# Altium schematic sheet MAX2829_RF.SchDoc
size A4
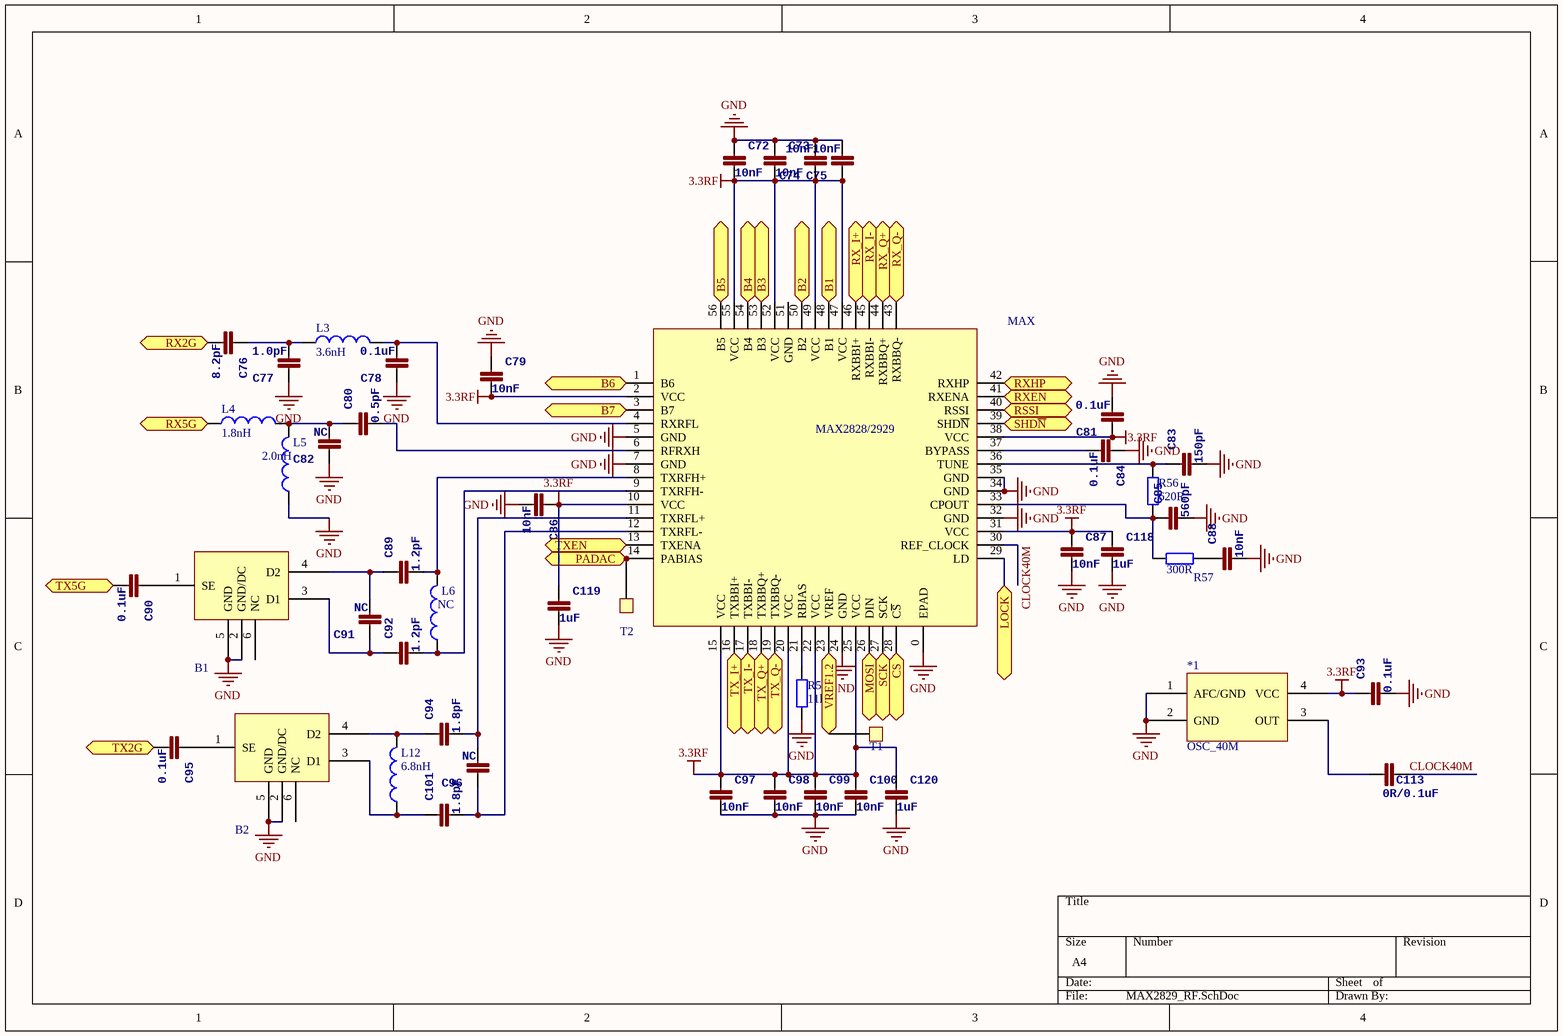
[diagram p0: MAX2829_RF.SchDoc]

## Parts
*1  OSC_40M  [TXC_7Q]
B1  Balun  [HHM1711D1/HHM1732B1]  (value not drawn)
B2  Balun  [HHM1711D1/HHM1732B1]  (value not drawn)
C72  10nF  [0402]
C73  10nF  [0402]
C74  10nF  [0402]
C75  10nF  [0402]
C76  8.2pF  [0402]
C77  1.0pF  [0402]
C78  0.1uF  [0402]
C79  10nF  [0402]
C80  0.5pF  [0402]
C81  0.1uF  [0402]
C82  NC  [0402]
C83  150pF  [0402]
C84  0.1uF  [0402]
C85  560pF  [0402]
C86  10nF  [0402]
C87  10nF  [0402]
C88  10nF  [0402]
C89  1.2pF  [0402]
C90  0.1uF  [0402]
C91  NC  [0402]
C92  1.2pF  [0402]
C93  0.1uF  [0402]
C94  1.8pF  [0402]
C95  0.1uF  [0402]
C96  NC  [0402]
C97  10nF  [0402]
C98  10nF  [0402]
C99  10nF  [0402]
C100  10nF  [0402]
C101  1.8pF  [0402]
C113  0R/0.1uF  [0402]
C118  1uF  [0603]
C119  1uF  [0603]
C120  1uF  [0603]
L3  value 3.6nH  [0402]  (hidden comment: Inductor)
L4  value 1.8nH  [0402]  (hidden comment: Inductor)
L5  2.0nH  [0402]
L6  NC  [0402]
L12  value 6.8nH  [0402]  (hidden comment: Inductor)
MAX  MAX2828/2929  [QFN_56\MAX2829]
R56  620R  [0402]
R57  300R  [0402]
R58  11k  [0402]
T1  TestPad  [TestPad - 1mm]  (value not drawn)
T2  TestPad  [TestPad - 1mm]  (value not drawn)

## Ports
B1, B2, B3, B4, B5, B6, B7, CS, LOCK, MOSI, PADAC, RSSI, RX2G, RX5G, RX_I+, RX_I-, RX_Q+, RX_Q-, RXEN, RXHP, SCK, SHD~{N}, TX2G, TX5G, TX_I+, TX_I-, TX_Q+, TX_Q-, TXEN, VREF1.2

## Nets
3.3RF: *1.4(VCC) C72.2 C73.2 C74.1 C75.1 C79.2 C81.1 C86.1 C87.1 C93.1 C97.1 C98.1 C99.1 C100.1 C118.1 C119.1 C120.1 MAX.2(VCC) MAX.10(VCC) MAX.15(VCC) MAX.20(VCC) MAX.22(VCC) MAX.25(VCC) MAX.31(VCC) MAX.38(VCC) MAX.47(VCC) MAX.49(VCC) MAX.52(VCC) MAX.55(VCC)
GND: *1.1(AFC/GND) *1.2(GND) B1.2(GND/DC) B1.5(GND) B2.2(GND/DC) B2.5(GND) C72.1 C73.1 C74.2 C75.2 C77.1 C78.1 C79.1 C81.2 C82.1 C83.2 C84.1 C85.2 C86.2 C87.2 C88.2 C93.2 C97.2 C98.2 C99.2 C100.2 C118.2 C119.2 C120.2 L5.1 MAX.0(EPAD) MAX.5(GND) MAX.7(GND) MAX.24(GND) MAX.32(GND) MAX.34(GND) MAX.35(GND) R58.1
B1: MAX.48(B1) ; port B1
B2: MAX.50(B2) ; port B2
B3: MAX.53(B3) ; port B3
B4: MAX.54(B4) ; port B4
B5: MAX.56(B5) ; port B5
B6: MAX.1(B6) ; port B6
B7: MAX.3(B7) ; port B7
CLOCK40M: C113.2 MAX.30(REF_CLOCK)
CS: MAX.28(C~{S}) ; port CS
LOCK: MAX.29(LD) ; port LOCK
MOSI: MAX.26(DIN) ; port MOSI
PADAC: MAX.14(PABIAS) T2.1 ; port PADAC
RSSI: MAX.40(RSSI) ; port RSSI
RX2G: C76.2 ; port RX2G
RX5G: L4.1 ; port RX5G
RX_I+: MAX.46(RXBBI+) ; port RX_I+
RX_I-: MAX.45(RXBBI-) ; port RX_I-
RX_Q+: MAX.44(RXBBQ+) ; port RX_Q+
RX_Q-: MAX.43(RXBBQ-) ; port RX_Q-
RXEN: MAX.41(RXENA) ; port RXEN
RXHP: MAX.42(RXHP) ; port RXHP
SCK: MAX.27(SCK) ; port SCK
SHD~{N}: MAX.39(SHD~{N}) ; port SHD~{N}
TX2G: C95.2 ; port TX2G
TX5G: C90.2 ; port TX5G
TX_I+: MAX.16(TXBBI+) ; port TX_I+
TX_I-: MAX.17(TXBBI-) ; port TX_I-
TX_Q+: MAX.18(TXBBQ+) ; port TX_Q+
TX_Q-: MAX.19(TXBBQ-) ; port TX_Q-
TXEN: MAX.13(TXENA) ; port TXEN
VREF1.2: MAX.23(VREF) T1.1 ; port VREF1.2
Net*1_3: *1.3(OUT) C113.1
NetB1_1: B1.1(SE) C90.1
NetB1_3: B1.3(D1) C91.1 C92.1
NetB1_4: B1.4(D2) C89.1 C91.2
NetB2_1: B2.1(SE) C95.1
NetB2_3: B2.3(D1) C101.1 L12.1
NetB2_4: B2.4(D2) C94.1 L12.2
NetC76_1: C76.1 C77.2 L3.1
NetC78_2: C78.2 L3.2 MAX.4(RXRFL)
NetC80_1: C80.1 C82.2 L4.2 L5.2
NetC80_2: C80.2 MAX.6(RFRXH)
NetC83_1: C83.1 MAX.36(TUNE) R56.1
NetC84_2: C84.2 MAX.37(BYPASS)
NetC85_1: C85.1 MAX.33(CPOUT) R56.2 R57.1
NetC88_1: C88.1 R57.2
NetC89_2: C89.2 L6.2 MAX.8(TXRFH+)
NetC92_2: C92.2 L6.1 MAX.9(TXRFH-)
NetC94_2: C94.2 C96.2 MAX.11(TXRFL+)
NetC96_1: C96.1 C101.2 MAX.12(TXRFL-)
NetMAX_21: MAX.21(RBIAS) R58.2

Not connected (* = marked no-connect by the designer): B1 6(NC); B2 6(NC); MAX 51(GND)

## Library data of the parts
C72-C101 C113 C118-C120 = CAP0402-CAP: <b>Capacitor</b> / Standard 0603 ceramic capacitor, and 0.1" leaded capacitor.; PARTNO: CC0402ZRY5V7BB104
L3-L6 L12 = Inductor: Code_IEC: 1005; Published: 8-Jun-2000; LatestRevisionDate: 29-May-2009; LatestRevisionNote: IPC-7351 Footprint Added.; PackageReference: 0402-A; Publisher: Altium Limited; PackageDescription: Chip Inductor; Code_JEITA: 0402
R56-R58 = Res2: Resistor; Published: 8-Jun-2000; LatestRevisionDate: 17-Jul-2002; LatestRevisionNote: Re-released for DXP Platform.; PackageReference: AXIAL-0.4; Publisher: Altium Limited; PackageDescription: Axial Device, Thru-Hole; 2 Leads; 0.4 in Pin Spacing